# EAGLE schematic light-sink (EAGLE 7.0.0)
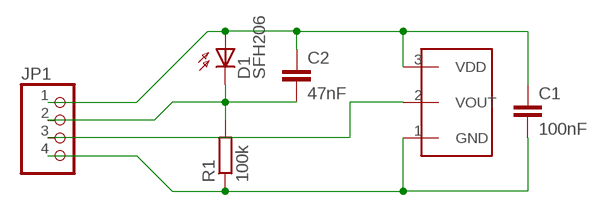
[diagram p0: schematic, sheet 1]

## Parts
C1  100nF  C-EU050-035X075  [C050-035X075]
C2  47nF  C-EU050-035X075  [C050-035X075]
D1  SFH206  [SFH206]
JP1  PINHD-1X4  [1X04]
R1  100k  R-EU_0207/10  [0207/10]
TSINK  MCP9701-TO92  [TO92]

## Nets
+5V: C1.1 C2.1 D1.A JP1.1 TSINK.3(VDD)
GND: C1.2 JP1.4 R1.1 TSINK.1(GND)
LIGHT: C2.2 D1.K(C) JP1.2 R1.2
N$3: JP1.3 TSINK.2(VOUT)

## Library data of the parts
C1 C2 = rcl:C-EU: CAPACITOR, European symbol
D1 = opto-trans-siemens:SFH206: PHOTO DIODE; MPN: SFH206K; OC_FARNELL: 1212741; OC_NEWARK: 01M8807
JP1 = pinhead:PINHD-1X4: PIN HEADER
R1 = rcl:R-EU_: RESISTOR, European symbol
TSINK = custom:MCP9701-TO92